# EAGLE design 3d_printer_neo_fan_control 2 (EAGLE 9.6.2)
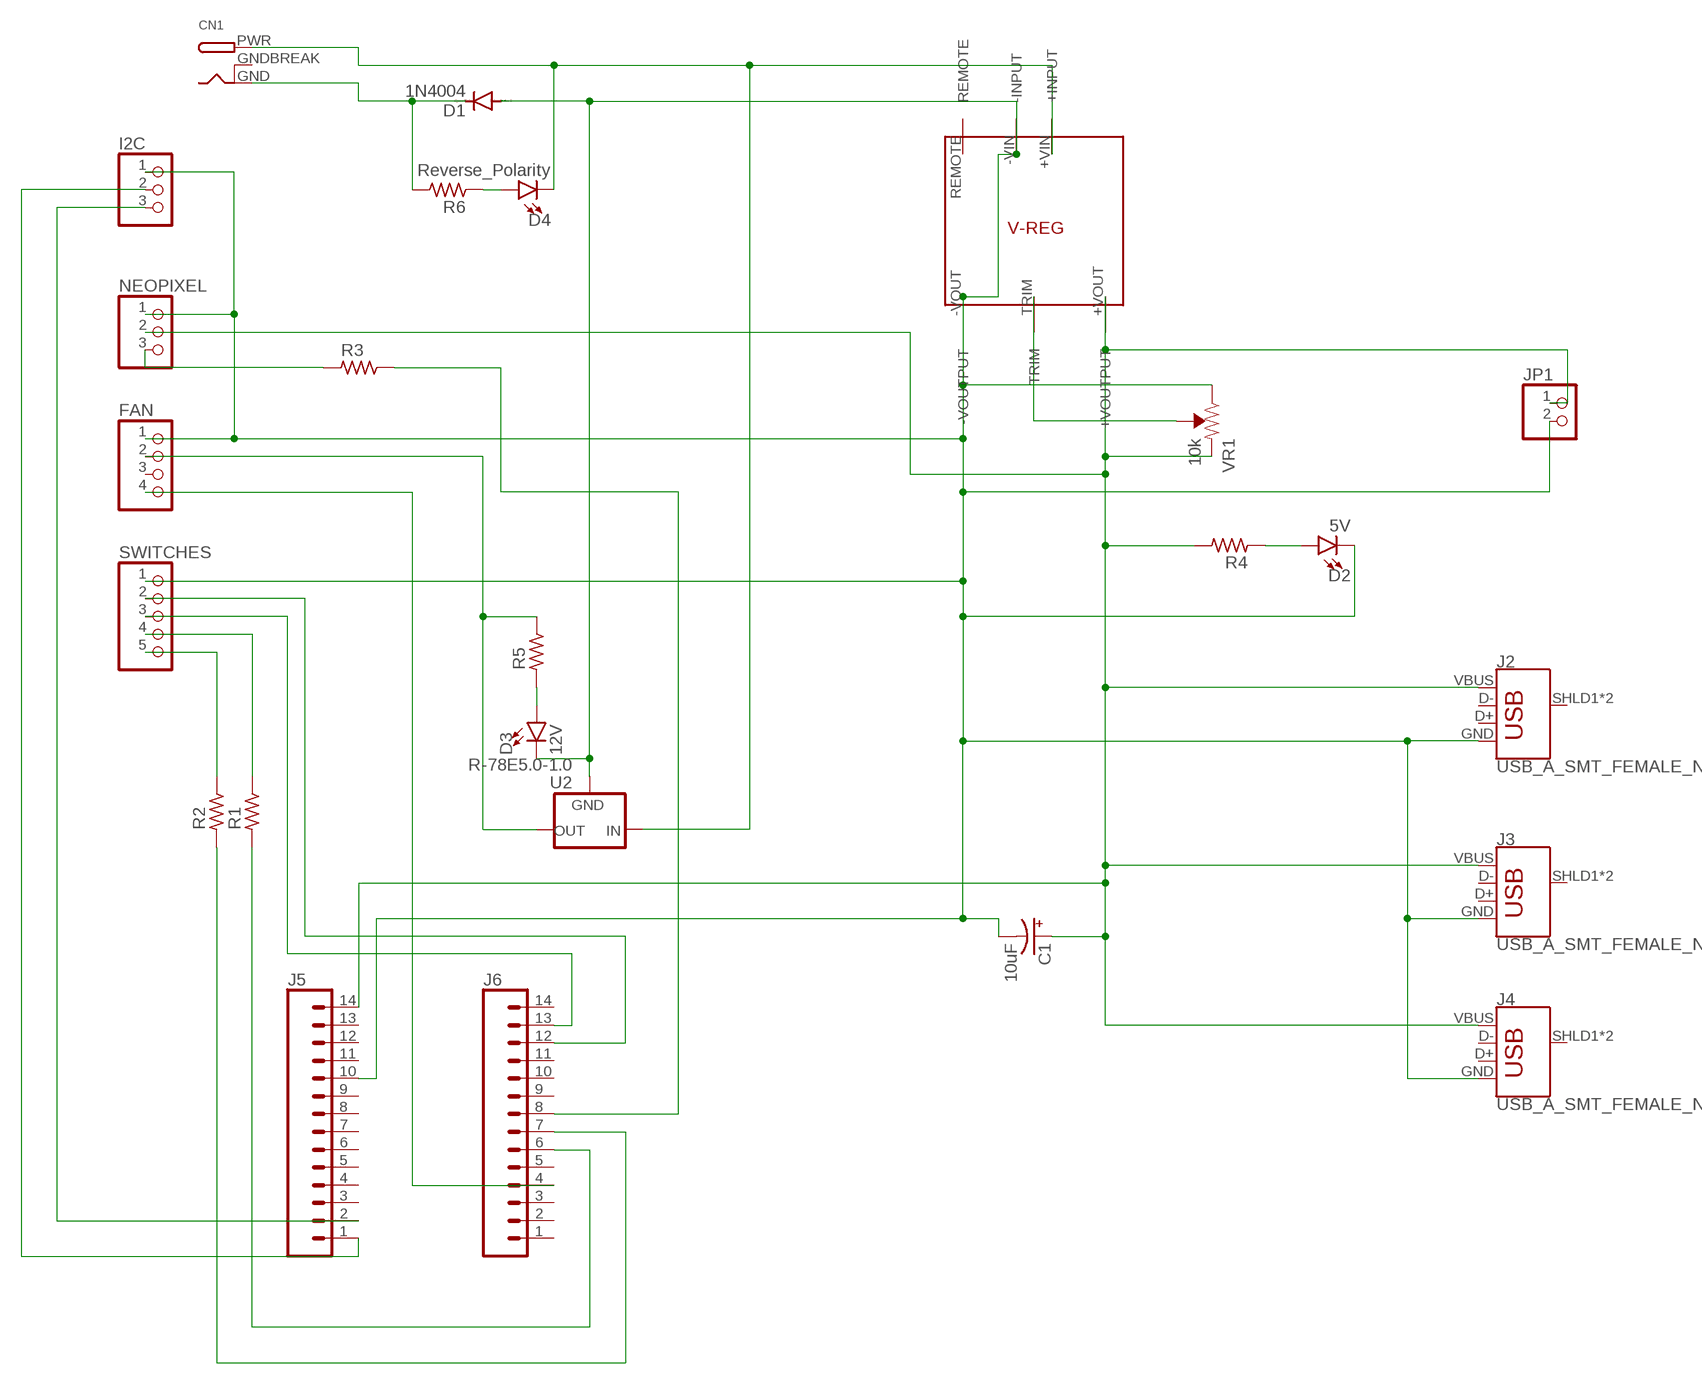
[diagram p0: schematic, sheet 1]

## Parts
C1  10uF  10UF-POLAR-RADIAL-2.5MM-KIT-25V-20%  [CPOL-RADIAL-2.5MM-5MM-KIT]
CN1  DCBARRELPTH  [DCJACK_2MM_PTH]
D1  1N4004  [DO41-10]
D2  5V  LED-GREEN1206  [LED-1206]
D3  12V  LED-GREEN1206  [LED-1206]
D4  Reverse_Polarity  LED-RED1206  [LED-1206]
FAN  PINHD-1X4  [1X04]
I2C  PINHD-1X3  [1X03]
J2  USB_A_SMT_FEMALE_NS  [USB-A-S-NOSILK-FEMALE]
J3  USB_A_SMT_FEMALE_NS  [USB-A-S-NOSILK-FEMALE]
J4  USB_A_SMT_FEMALE_NS  [USB-A-S-NOSILK-FEMALE]
J5  CONN_14  [1X14]
J6  CONN_14  [1X14]
JP1  PINHD-1X2  [1X02]
NEOPIXEL  PINHD-1X3  [1X03]
R1  RC-MASTER-SMD_R_1206MP  [RC-MASTER-SMD_R1206MP]
R2  RC-MASTER-SMD_R_1206MP  [RC-MASTER-SMD_R1206MP]
R3  RC-MASTER-SMD_R_1206MP  [RC-MASTER-SMD_R1206MP]
R4  RC-MASTER-SMD_R_1206MP  [RC-MASTER-SMD_R1206MP]
R5  RC-MASTER-SMD_R_1206MP  [RC-MASTER-SMD_R1206MP]
R6  RC-MASTER-SMD_R_1206MP  [RC-MASTER-SMD_R1206MP]
SWITCHES  PINHD-1X5  [1X05]
U2  R-78E5.0-1.0  [DC-DC_CONVERTER_78XX]
U$1  CINCON-EC4SBW  [CINCON-EC4SBW]
VR1  10k  TRIMPOT-SMD-3MM-OPEN-1/10W-25%  [TRIMPOT-SMD-TC33X]

## Nets
5V [PWR]: C1.1(+) J2.VBUS J3.VBUS J4.VBUS J5.14 JP1.1 NEOPIXEL.2 R4.2 U$1.+VOUT(+VOUTPUT) VR1.3(CCW)
5V_GND: C1.2(-) D1.A D2.C D3.C FAN.1 I2C.1 J2.GND J3.GND J4.GND J5.10 JP1.2 NEOPIXEL.1 SWITCHES.1 U2.GND U$1.-VIN(-INPUT) U$1.-VOUT(-VOUTPUT) VR1.1(CW)
12V [PWR]: FAN.2 R5.2 U2.VOUT(OUT)
DIODE [BIG PWR]: CN1.GND D1.C R6.2
N$1: D3.A R5.1
N$2: D4.A R6.1
N$3: U$1.TRIM VR1.2(WIPER)
N$4: D2.A R4.1
N$7: R2.2 SWITCHES.5
N$8: FAN.4 J6.4
N$9: R1.2 SWITCHES.4
N$10: J6.6 R1.1
N$11: J6.7 R2.1
N$12: NEOPIXEL.3 R3.1
N$13: J6.13 SWITCHES.3
N$14: J6.12 SWITCHES.2
N$15: J6.8 R3.2
N$16: I2C.2 J5.1
N$17: I2C.3 J5.2
VIN [BIG PWR]: CN1.PWR D4.C U2.VIN(IN) U$1.+VIN(+INPUT)
Unconnected: FAN.3 J2.D+ J2.D- J2.SHLD1(SHIELD) J2.SHLD2(SHIELD) J3.D+ J3.D- J3.SHLD1(SHIELD) J3.SHLD2(SHIELD) J4.D+ J4.D- J4.SHLD1(SHIELD) J4.SHLD2(SHIELD) J5.3 J5.4 J5.5 J5.6 J5.7 J5.8 J5.9 J5.11 J5.12 J5.13 J6.1 J6.2 J6.3 J6.5 J6.9 J6.10 J6.11 J6.14 U$1.REMOTE

## Power pins joined to a net without a drawn wire
GNDBREAK: CN1.GNDBREAK

## Library data of the parts
C1 = SparkFun-Capacitors:10UF-POLAR: 10.0µF polarized capacitors A capacitor is a passive two-terminal electrical component used to store electrical energy temporarily in an electric field.; PROD_ID: CAP-08440
CN1 = adafruit:DCBARREL: 2.0mm DC Barrel Jack DCJACK_2MM_PTH - Through Hole Jack (4UConnector: 05537)
D1 = diode:1N4004: DIODE general purpose rectifier, 1 A
D2 D3 = SparkFun-LED:LED-GREEN: Green SMD LED Used in manufacturing of various products at SparkFun Packages: 0603 - SMD 0603 package [Product Link] <http://www.futureelectronics.com/en/technologies/semiconductors/optoelectronics/leds/Pages/9894312-LTST-C190GKT.aspx?CrossPart=HSMG-C190&IM=0> LilyPad 1206 - SMD1206 LilyPad package [Product Link] <http://www.futureelectronics.com/en/Technologies/Product.aspx?ProductID=IN150NGHARVATEKCORPORATION2049943&IM=0> 1206 - SMD1206 package [Product Link] <http://www.futureelectronics.com/en/technologies/semiconductors/optoelectronics/leds/Pages/8315665-LTST-C150KGKT.aspx?IM=0> 1206 Bottom Mount -SMD 1206 Bottom Mount [Product Link] <http://www.digikey.com/product-detail/en/lite-on-inc/LTST-C230KGKT/160-1456-1-ND/386854> SparkFun Products: Pro Mini 328 -5V <https://www.sparkfun.com/products/821> RedBoard <https://www.sparkfun.com/products/12757> MP3 Trigger <https://www.sparkfun.com/products/13720> Makey Makey <https://www.sparkfun.com/products/11076>; PROD_ID: DIO-00862; VALUE: GREEN
D4 = SparkFun-LED:LED-RED: Red SMD LED Used in manufacturing of most products at SparkFun Packages: 0603 - SMD 0603 package [Product Link] <http://docs.avagotech.com/docs/AV02-0551EN> 0603 SMART - SMD 0603 SMART package ( more efficient and expensive)[Product Link] <http://www.osram-os.com/Graphics/XPic2/00077099_0.pdf> 1206 - SMD1206 package [Product Link] <https://www.sparkfun.com/datasheets/DevTools/LilyPad/Q150OVS4.pdff> SparkFun Products: Pro Mini 328 -5V <https://www.sparkfun.com/products/821> RedBoard <https://www.sparkfun.com/products/12757> IOIO-OTG <https://www.sparkfun.com/products/13613>; PROD_ID: DIO-09912; VALUE: RED
FAN = Connector:PINHD-1X4: PIN HEADER; CATEGORY: CONNECTOR; SUB-CATEGORY: PIN-HEADER
I2C NEOPIXEL = Connector:PINHD-1X3: PIN HEADER; CATEGORY: CONNECTOR; SUB-CATEGORY: PIN-HEADER
J2-J4 = SparkFun-Connectors:USB_A: USB-A Connector Male and female variants, as well as PTH and SMT variants SparkFun Products: SparkFun XBee Explorer Dongle <https://www.sparkfun.com/products/11697> PTH Male SparkFun MicroView-USB Programmer <https://www.sparkfun.com/products/12924> SMT Male SparkFun USB Type A Female Breakout <https://www.sparkfun.com/products/12700> SMT Female; PROD_ID: CONN-09520; SF_ID: PRT-09011
J5 J6 = SparkFun-Connectors:CONN_14: Multi connection point. Often used as Generic Header-pin footprint for 0.1 inch spaced/style header connections On any of the 0.1 inch spaced packages, you can populate with these: Break Away Headers - Straight <https://www.sparkfun.com/products/116> (PRT-00116) Break Away Male Headers - Right Angle <https://www.sparkfun.com/products/553> (PRT-00553) Female Headers <https://www.sparkfun.com/products/115> (PRT-00115) Break Away Headers - Machine Pin <https://www.sparkfun.com/products/117> (PRT-00117) Break Away Female Headers - Swiss Machine Pin <https://www.sparkfun.com/products/743> (PRT-00743) For SCREWTERMINALS and SPRING TERMINALS visit here: Screw Terimnals on SparkFun.com <https://www.sparkfun.com/search/results?term=Screw+Terminals> (5mm/3.5mm/2.54mm spacing) This device is also useful as a general connection point to wire up your design to another part of your project. Our various solder wires solder well into these plated through hole pads. Hook-Up Wire - Assortment (Stranded, 22 AWG) <https://www.sparkfun.com/products/11375> (PRT-11375) Hook-Up Wire - Assortment (Solid Core, 22 AWG) <https://www.sparkfun.com/products/11367> (PRT-11367) View the entire wire category on our website here <https://www.sparkfun.com/categories/141> Special notes: Molex polarized connector foot print use with SKU : PRT-08231 with associated crimp pins and housings. 1MM SMD Version SKU: PRT-10208 NOTES ON THE VARIANTS LOCK and LOCK_LONGPADS... This footprint was designed to help hold the alignment of a through-hole component (i.e. 6-pin header) while soldering it into place. You may notice that each hole has been shifted either up or down by 0.005 of an inch from it's more standard position (which is a perfectly straight line). This slight alteration caused the pins (the squares in the middle) to touch the edges of the holes. Because they are alternating, it causes a "brace" to hold the component in place. 0.005 has proven to be the perfect amount of "off-center" position when using our standard breakaway headers. Although looks a little odd when you look at the bare footprint, once you have a header in there, the alteration is very hard to notice. Also,if you push a header all the way into place, it is covered up entirely on the bottom side.
JP1 = DC_LOAD_AU:PINHD-1X2: PIN HEADER
R1-R6 = 52101-101-REV-A:RC-MASTER-SMD_R_: RESISTOR
SWITCHES = Connector:PINHD-1X5: PIN HEADER; CATEGORY: CONNECTOR; SUB-CATEGORY: PIN-HEADER
U2 = SparkFun-IC-Power:R-78E5.0-1.0: Recom Power 5V 1A DC/DC Converter The Recom R-78E5.0-X.X is a compact DC/DC converter module that is a pin for pin drop-in replacement for the LM7805 linear voltage regulator. Specifications: Input Range: 7-28V Output Voltage: 5V Output Current: 1A Max Efficiency: 91% Datasheet <https://www.recom-power.com/pdf/Innoline/R-78Exx-1.0.pdf>; PROD_ID: COM-13655
U$1 = MY_LIBRARY:CINCON-EC4SBW: Cincon-EC4SBW 5V Regulator High Current Bleh
VR1 = SparkFun-Resistors:TRIMPOT: Trimming Potentiometer (Trimpot) Three-terminal potentiometers, with an adjustable wiper and two adjustable resistors. A pot can be used to create a configurable voltage divider, or as a variable resistor. "Trimpots" are a subset of potentiometers, usually intended for "set-and-forget" applications. They're often more delicate than standard potentiometers - rated for fewer turns. Variants PTH-KNOB - PTH Trimpot w/ finger-adjustable knob Trimpot 10K with Knob <https://www.sparkfun.com/products/9806> (COM-09806) Datasheet <http://www.sparkfun.com/datasheets/Components/General/TSR-3386.pdf> SMD-3MM-CLOSED-FRAME - SMD 3mm Square Closed-Frame Trimpot Used on e.g. EasyDriver - Stepper Motor Driver <https://www.sparkfun.com/products/12779> Datasheet <http://www.bitechnologies.com/pdfs/22.pdf> (22AR10KTR) SMD-5MM - SMD 5mm Square Closed-Frame Trimpot Used on e.g. IOIO-OTG - V2.2 <https://www.sparkfun.com/products/13613> Datasheet <http://www.vishay.com/docs/51008/ts53.pdf> (TS53YL502MR10) SMD-3MM-1/10W-25% - 3mm Square Open-Frame Trimpot Used on e.g. SparkFun Shapeoko <https://www.sparkfun.com/products/13899> Datasheet <http://www.bourns.com/docs/Product-Datasheets/TC33.pdf> (TC33X-2-103E); PROD_ID: RES-12428

## Net classes
0 default: width 0.381 mm
1 PWR: width 0.381 mm
2 BIG PWR: width 0.381 mm

## Board
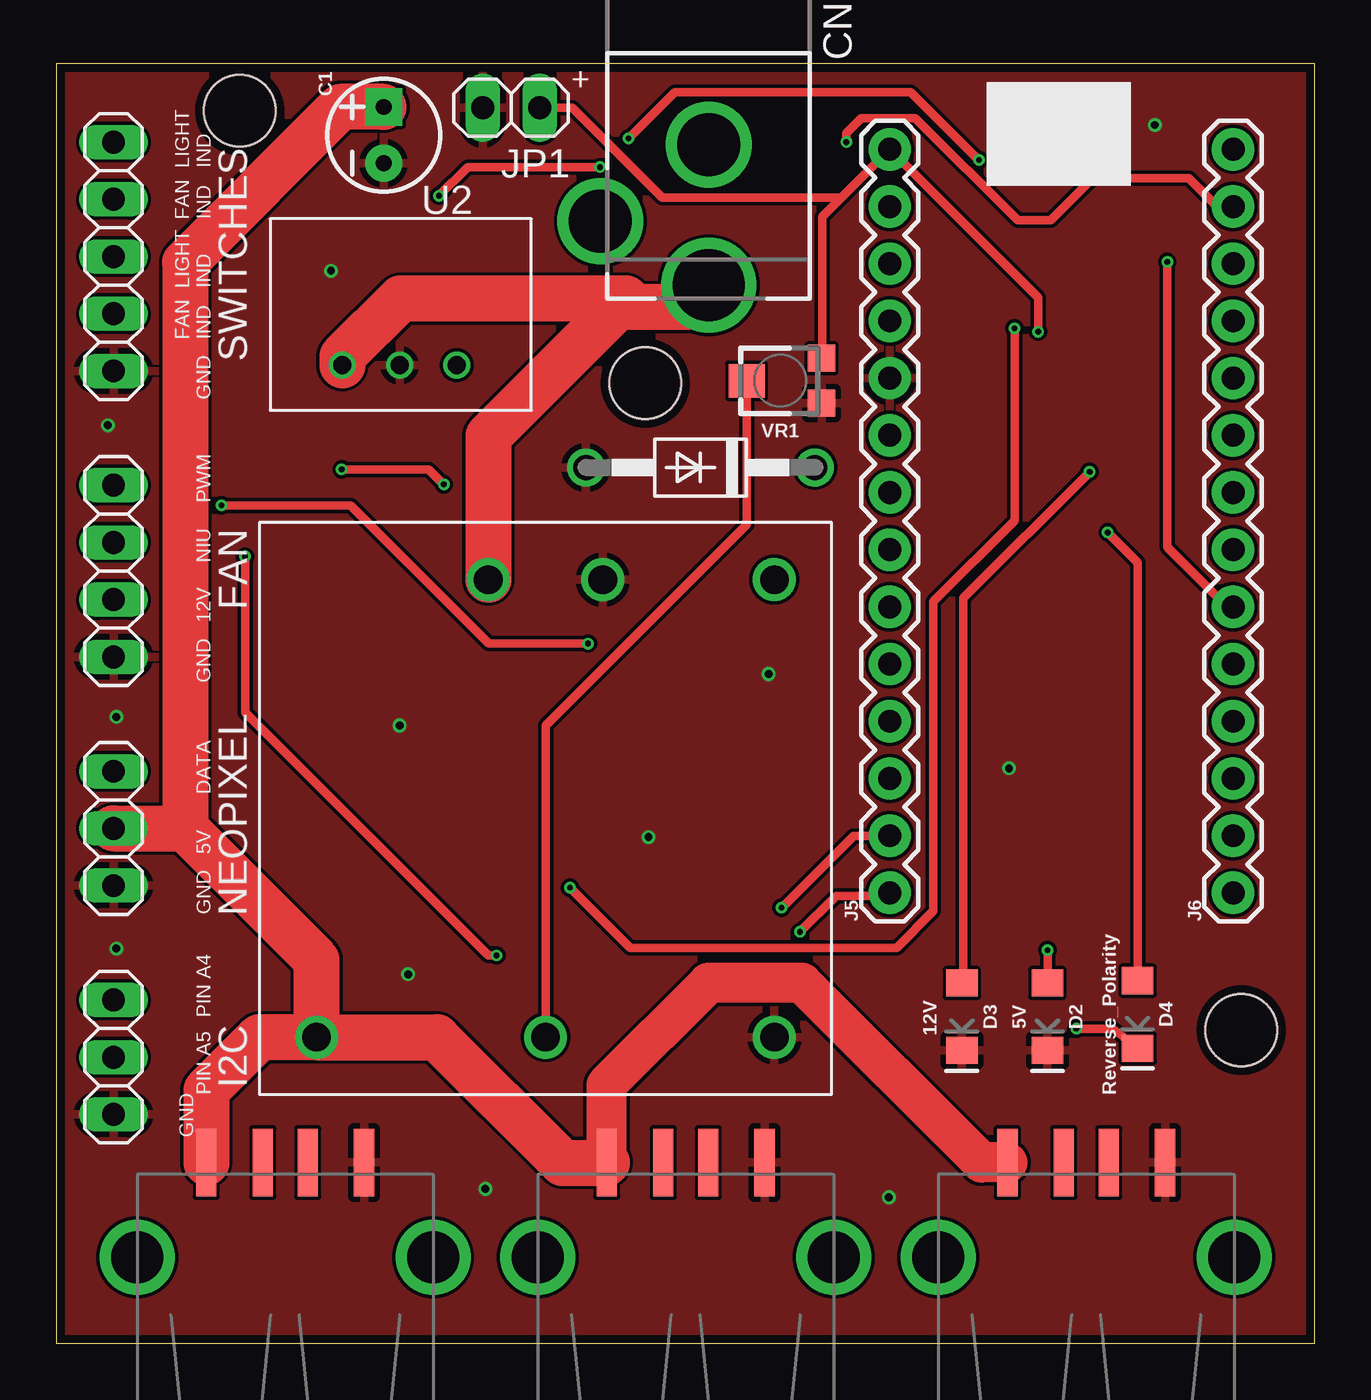
[diagram p1: board, top side]
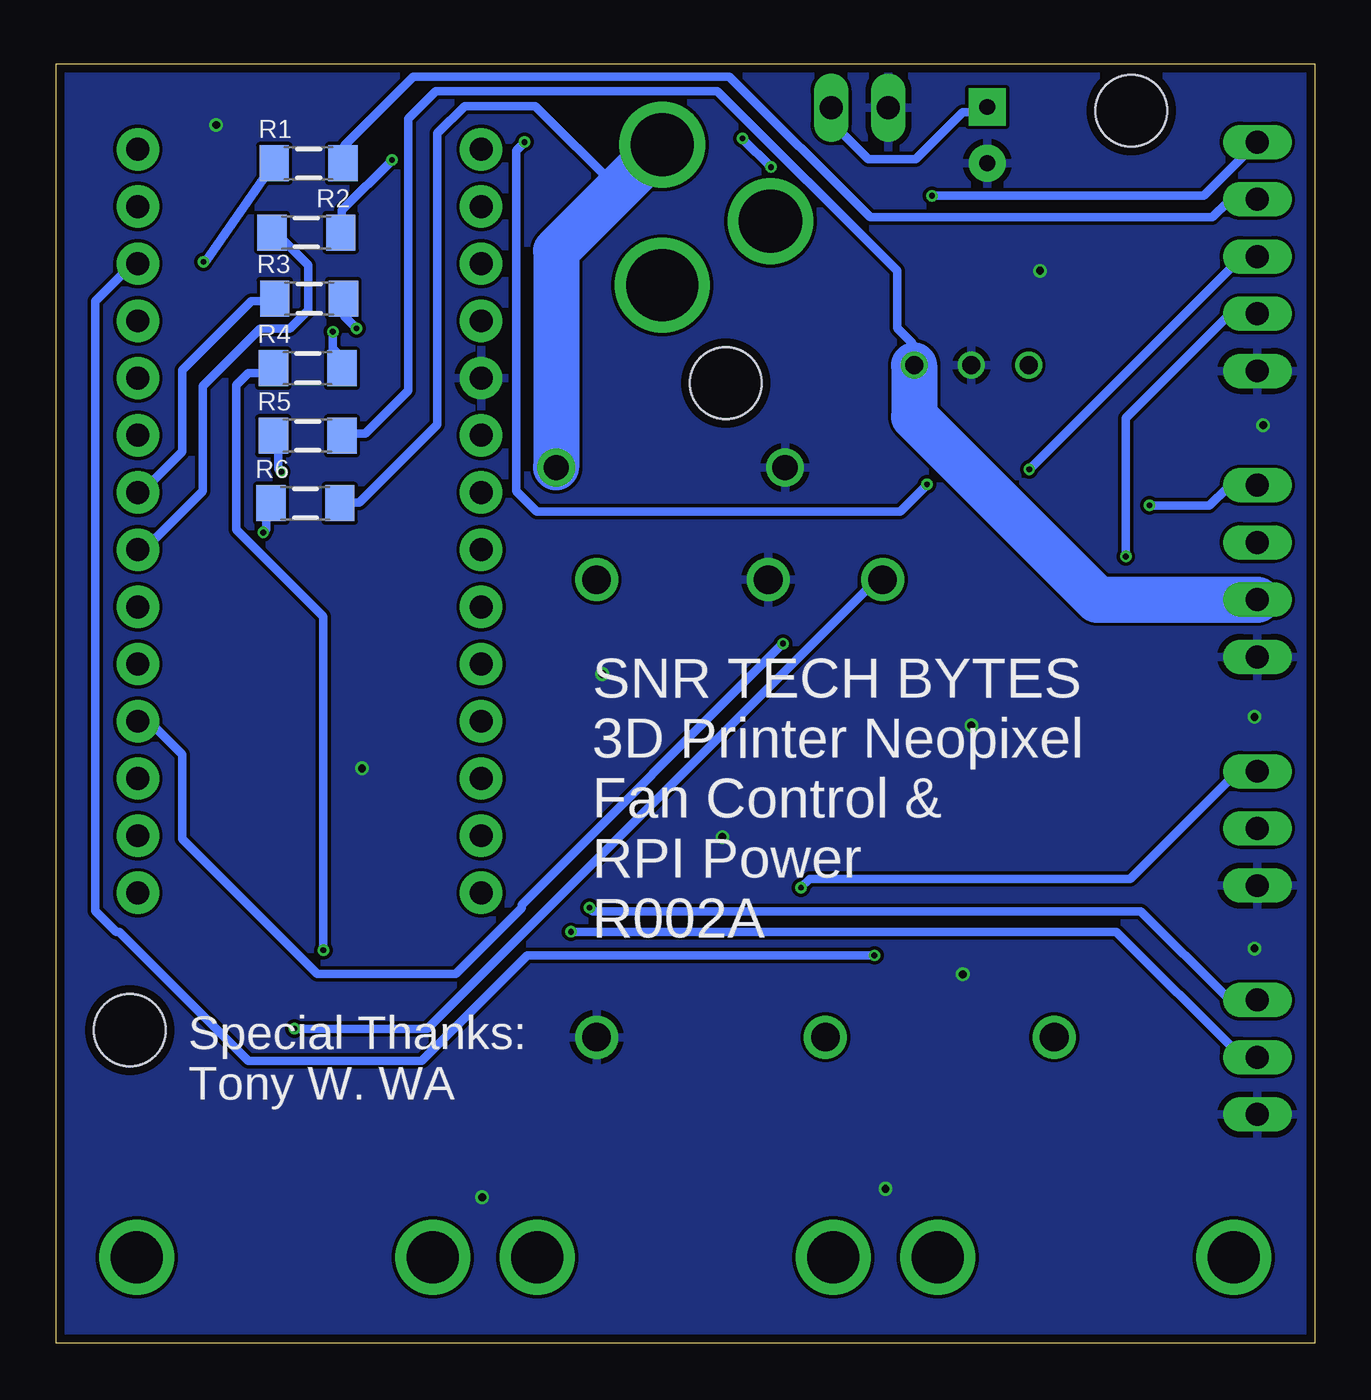
[diagram p2: board, bottom side, seen from below]

Size 55.86 x 56.82 mm. Coordinates in mm from the lower left corner, seen from the top.
Outline: 0,0 55.86,0 55.86,56.82 0,56.82 0,0
Copper layers (1*16): Top 0.035559375mm / dielectric 1.6mm / Bottom 0.035559375mm
Design rules "oshpark-2layer-tented": minimum track width 6mil, minimum drill 10mil, track to track 6mil, track to pad 6mil, pad to pad 6mil, via to via 6mil, smd to smd 6mil, copper to edge 15mil, drill to drill 6mil, minimum pad ring 5mil, minimum via ring 5mil, stop-mask expansion 2.5mil, vias tented up to drill 20mil, thermal gap 10mil
Holes 3.2 mm at 8.14,54.73 26.14,42.64 52.6,13.9

### Footprints (pad centres in the part's own frame; a part is rotated, then mirrored left to right if it is on the bottom)
CPOL-RADIAL-2.5MM-5MM-KIT = drill 0.7 pad 1.651 square: 1 1.25,0 | drill 0.7 pad 1.651: 2 -1.25,0
DCJACK_2MM_PTH = drill 2.8: GND 0,7.35; GNDBREAK 4.8,10.75 | drill 3.2: PWR 0,13.6
DO41-10 = drill 1.118: A 5.08,0; C -5.08,0
LED-1206 = smd 1.2 x 1.4: A -1.5,0; C 1.5,0
1X04 = drill 1.016 long: 1 -3.81,0; 2 -1.27,0; 3 1.27,0; 4 3.81,0
1X03 = drill 1.016 long: 1 -2.54,0; 2 0,0; 3 2.54,0
USB-A-S-NOSILK-FEMALE = smd 3 x 0.9: D+ 6.752,-1; D- 6.752,1; GND 6.752,-3.5; VBUS 6.752,3.5 | drill 2.311: SHLD1 2.54,-6.566; SHLD2 2.54,6.566
1X14 = drill 1.016 pad 1.88: 1 0,0; 2 2.54,0; 3 5.08,0; 4 7.62,0; 5 10.16,0; 6 12.7,0; 7 15.24,0; 8 17.78,0; 9 20.32,0; 10 22.86,0; 11 25.4,0; 12 27.94,0; 13 30.48,0; 14 33.02,0
1X02 = drill 1.016 long: 1 -1.27,0; 2 1.27,0
RC-MASTER-SMD_R1206MP = smd 1.3 x 1.6: 1 -1.524,0; 2 1.524,0
1X05 = drill 1.016 long: 1 -5.08,0; 2 -2.54,0; 3 0,0; 4 2.54,0; 5 5.08,0
DC-DC_CONVERTER_78XX = drill 0.8: GND 0,0; VIN -2.54,0; VOUT 2.54,0
CINCON-EC4SBW = drill 1.27: +VIN -2.54,2.54; +VOUT -10.16,-17.78; -VIN 2.54,2.54; -VOUT 10.16,-17.78; REMOTE 10.16,2.54; TRIM 0,-17.78
TRIMPOT-SMD-TC33X = smd 1.2 x 1.2: 1 -1,-1.825; 3 1,-1.825 | smd 1.5 x 1.6: 2 0,1.5

### Placement (x,y rotation side)
C1  14.53,53.65 90 top
CN1  28.96,60.58 180 top
D1  28.59,38.89 180 top
D2  44,14.5 270 top
D3  40.2,14.5 270 top
D4  48,14.6 270 top
FAN  2.54,34.29 90 top
I2C  2.54,12.7 90 top
J2  45.72,1.27 90 top
J3  27.94,1.27 90 top
J4  10.16,1.27 90 top
J5  37,20 90 top
J6  52.24,20 90 top
JP1  20.19,54.86 180 top
NEOPIXEL  2.54,22.86 90 top
R1  44.66,52.4 0 bottom
R2  44.76,49.32 0 bottom
R3  44.64,46.39 180 bottom
R4  44.7,43.3 0 bottom
R5  44.7,40.3 0 bottom
R6  44.8,37.3 0 bottom
SWITCHES  2.54,48.26 90 top
U2  15.24,43.43 0 top
U$1  21.72,31.37 0 top
VR1  32.14,42.74 90 top

### Tracks (layer width: path | path; a pad name or v marks a point on that pad's centre or on a via)
5V  (via drill 0.25)
  Top 0.381: VR1.3 34,43.87 34,50.02 34.85,50.87 | v43.59,44.92 43.59,46.43 J5.14 34.85,50.87 | JP1.1 22.9,54.86 26.89,50.87 34.85,50.87
  Top 1.778: J2.VBUS 41.08,8.02 33.1,16 28.96,16 24.42,11.46 24.42,8
  Top 2.032: U$1.+VOUT 11.56,17.02 5.71,22.86 | NEOPIXEL.2 5.71,22.86 | U$1.+VOUT 16.89,13.59 22.48,8 24.42,8 J3.VBUS | C1.1 12.61,54.9 5.71,48.01 5.71,22.86 | U$1.+VOUT 9.02,13.59 6.66,11.23 J4.VBUS
  Bottom 0.381: C1.1 14.54,54.81 14.67,54.67 15.62,54.67 17.72,52.58 19.81,52.58 21.46,54.23 JP1.1 | R4.2 42.95,43.52 43.59,44.16 v43.59,44.92
5V_GND  (via drill 0.35)
  other vias: 2.29,40.77 2.67,27.81 2.67,17.53 15.24,27.43 15.62,16.38 26.29,22.48 31.62,29.72 19.05,6.86 36.96,6.48 42.29,25.53 12.19,47.62 48.77,54.1
  pour Top: 56.77,57.53 -1.52,57.53 -1.52,-3.43 56.77,-3.43
  pour Bottom: 56.77,57.53 56.77,-3.43 -1.91,-3.43 -1.91,57.53
12V
  Bottom 0.381: R5.2 43.07,40.41 42.14,40.41 40.23,42.31 40.23,54.39 39.01,55.61 26.52,55.61 18.54,47.62 18.54,45.07 17.87,44.41 U2.VOUT
  Bottom 2.032: U2.VOUT 17.78,41.15 9.65,33.02 FAN.2
DIODE
  Bottom 0.381: 30.92,51.27 34.59,54.94 37.74,54.94 38.94,53.74 38.94,40.8 42.41,37.34 43.2,37.34 R6.2
  Bottom 2.032: CN1.GND 30.92,51.27 33.67,48.51 D1.C
N$1  (via drill 0.25)
  Top 0.381: D3.A 40.27,16 40.27,33.09 v45.87,38.69
  Bottom 0.381: v45.87,38.69 46.01,38.82 46.01,40.14 46.14,40.27 R5.1
N$2  (via drill 0.25)
  Top 0.381: v46.67,36.01 48.01,34.67 48.01,16.14 D4.A
  Bottom 0.381: v46.67,36.01 46.54,36.14 46.54,37.07 46.41,37.2 R6.1
N$3
  Top 0.381: U$1.TRIM 21.72,27.43 30.64,36.36 VR1.2
N$4  (via drill 0.25)
  Top 0.381: v44.01,17.45 D2.A
  Bottom 0.381: v44.01,17.45 44.01,32.27 47.87,36.14 47.87,42.54 47.34,43.07 46.41,43.07 46.27,43.2 R4.1
N$7  (via drill 0.25)
  Top 0.381: v40.96,52.55 37.94,55.56 27.46,55.56 v25.4,53.5 | v24.13,52.23 18.26,52.23 v16.99,50.96
  Bottom 0.381: v40.96,52.55 43.18,50.32 43.18,49.37 R2.2 | v24.13,52.23 v25.4,53.5 | v16.99,50.96 4.92,50.96 SWITCHES.5
N$8  (via drill 0.25)
  Top 0.381: v7.33,37.2 13.07,37.2 19.2,31.07 v23.6,31.07
  Bottom 0.381: v7.33,37.2 4.67,37.2 3.87,38.01 2.67,38.01 FAN.4 | v23.6,31.07 35.2,19.47 35.2,19.34 38.14,16.4 44.27,16.4 50.27,22.4 50.27,26.14 51.74,27.6 52.14,27.6 J6.4
N$9
  Bottom 0.381: R1.2 43.07,52.41 43.07,53.18 40.01,56.25 25.98,56.25 19.74,50.01 4.53,50.01 3.87,50.67 2.67,50.67 SWITCHES.4
N$10  (via drill 0.25)
  Top 0.381: v49.32,48.02 49.32,35.36 51.87,32.8 52.14,32.8 J6.6
  Bottom 0.381: v49.32,48.02 49.21,48.07 R1.1
N$11
  Bottom 0.381: R2.1 46.27,49.21 46.01,49.21 44.67,47.87 44.67,45.87 45.49,45.05 46.81,45.05 49.36,42.5 49.36,37.85 51.87,35.34 52.14,35.34 J6.7
N$12  (via drill 0.25)
  Top 0.381: v42.54,45.07 42.54,36.54 38.94,32.94 38.94,19.2 37.3,17.56 25.47,17.56 v22.8,20.23
  Bottom 0.381: v42.54,45.07 43.07,45.61 43.07,46.27 R3.1 | v22.8,20.23 22.42,20.61 8.19,20.61 3.47,25.34 2.67,25.34 NEOPIXEL.3
N$13  (via drill 0.25)
  Top 0.381: v12.67,38.8 16.54,38.8 v17.2,38.14 | v35.07,53.34 35.07,53.74 35.74,54.41 38.14,54.41 42.67,49.87 44.14,49.87 46.01,51.74 50.27,51.74 51.47,50.54 52.14,50.54 J6.13
  Bottom 0.381: v12.67,38.8 3.33,48.14 2.67,48.14 SWITCHES.3 | v17.2,38.14 18.4,36.94 34.54,36.94 35.45,37.85 35.45,52.96 v35.07,53.34
N$14  (via drill 0.25)
  Top 0.381: v8.38,34.94 8.38,28 19.16,17.22 v19.55,17.22
  Bottom 0.381: v8.38,34.94 8.38,41.09 3.87,45.61 2.67,45.61 SWITCHES.2 | J6.12 52.27,47.87 52.54,47.87 54.14,46.27 54.14,19.2 53.21,18.27 53.07,18.27 47.34,12.54 39.64,12.54 34.96,17.22 v19.55,17.22
N$15
  Bottom 0.381: R3.2 46.27,46.27 47.21,46.27 50.27,43.2 50.27,39.6 52.14,37.74 J6.8
N$16  (via drill 0.25)
  Top 0.381: v33.01,18.27 34.61,19.87 36.94,19.87 J5.1
  Bottom 0.381: v33.01,18.27 8.8,18.27 3.33,12.8 2.67,12.8 I2C.2
N$17  (via drill 0.25)
  Top 0.381: v32.19,19.34 35.4,22.54 36.94,22.54 J5.2
  Bottom 0.381: v32.19,19.34 32.04,19.18 7.71,19.18 3.87,15.34 2.67,15.34 I2C.3
VIN  (via drill 0.25)
  Top 0.381: v45.28,13.96 46.92,13.96 D4.C
  Top 2.032: CN1.PWR 27.99,46.02 24.9,46.02 | 24.9,46.02 25.28,46.4 15.28,46.4 12.7,43.81 U2.VIN | 24.9,46.02 19.18,40.29 U$1.+VIN
  Bottom 0.381: v45.28,13.96 39.4,13.96 19.49,33.87 19.2,33.87 U$1.+VIN

### Text on the board
bPlace: SNR TECH BYTES / 3D Printer Neopixel / Fan Control & / RPI Power / R002A
tNames: + | LIGHT / IND | FAN / IND | LIGHT / IND | FAN / IND | GND | PWM | NIU | 12V | GND | DATA | 5V | GND | PIN A4 | PIN A5 | GND
bNames: Special Thanks: / Tony W. WA
tValues: - | D1 | U1